# Altium schematic sheet connector2.SchDoc
size A3; SheetNumber: 2; SheetTotal: 6
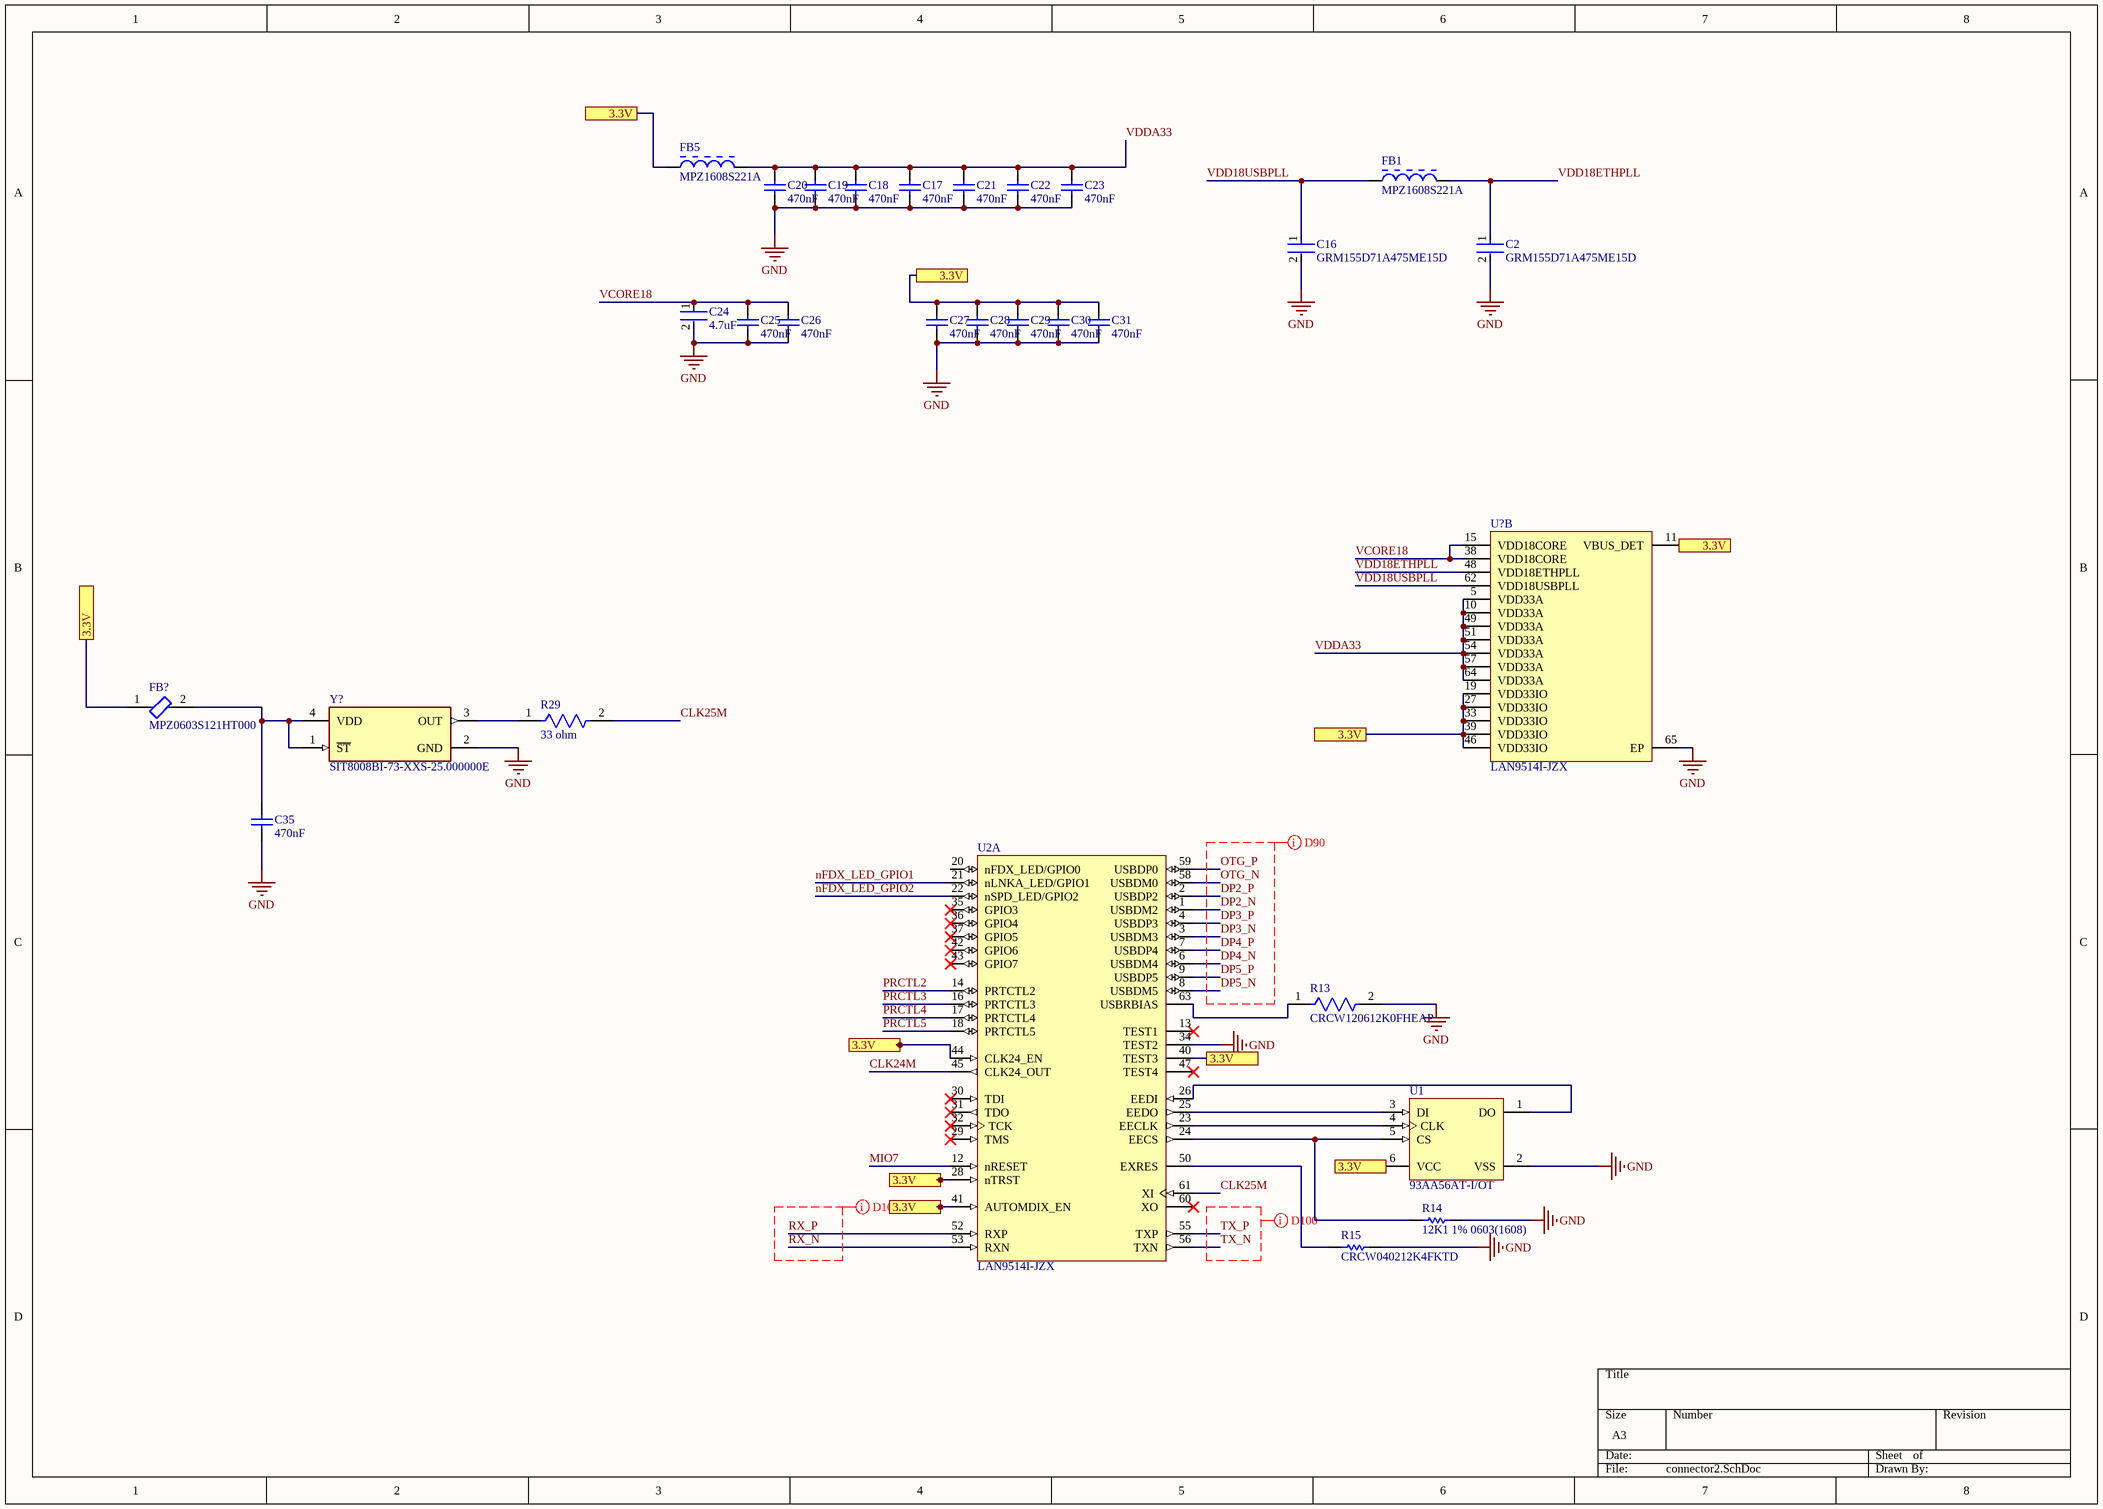
[diagram p0: connector2.SchDoc]

## Parts
C2  GRM155D71A475ME15D  [FP-GRM155-0_2-MFG]
C16  GRM155D71A475ME15D  [FP-GRM155-0_2-MFG]
C17  470nF  [CAPC2013X140X50ML20T25]
C18  470nF  [CAPC2013X140X50ML20T25]
C19  470nF  [CAPC2013X140X50ML20T25]
C20  470nF  [CAPC2013X140X50ML20T25]
C21  470nF  [CAPC2013X140X50ML20T25]
C22  470nF  [CAPC2013X140X50ML20T25]
C23  470nF  [CAPC2013X140X50ML20T25]
C24  4.7uF  [FP-GRM155-0_2-MFG]
C25  470nF  [CAPC2013X140X50ML20T25]
C26  470nF  [CAPC2013X140X50ML20T25]
C27  470nF  [CAPC2013X140X50ML20T25]
C28  470nF  [CAPC2013X140X50ML20T25]
C29  470nF  [CAPC2013X140X50ML20T25]
C30  470nF  [CAPC2013X140X50ML20T25]
C31  470nF  [CAPC2013X140X50ML20T25]
C35  470nF  [CAPC2013X140X50ML20T25]
FB1  MPZ1608S221A  [BEAD1608X95X30VL15T20]
FB5  MPZ1608S221A  [BEAD1608X95X30VL15T20]
FB?  MPZ0603S121HT000  [FP-MPZ0603-IPC_C]
R13  CRCW120612K0FHEAP  [FP-CRCW1206-Pe3-IPC_A]
R14  12K1 1% 0603(1608)  [RESC0603(1608)_M]
R15  CRCW040212K4FKTD  [RESC1005X40X25NL05T05]
R29  33 ohm  [FP-CR0805-IPC_C]
U1  93AA56AT-I/OT  [SOT-23-OT6_M]
U2  LAN9514I-JZX  [MCHP-QFN-64-7300x7300TP_V]  (part A of 2)
U?  LAN9514I-JZX  [MCHP-QFN-64-7300x7300TP_V]  (part B of 2)
Y?  SIT8008BI-73-XXS-25.000000E  [FP-SiT8008-7-MFG]

## Ports
3.3V (see connector1[2A], connector2[1B], connector2[3A], connector2[4A], connector2[4C], connector2[4D], connector2[5C], connector2[6B], connector2[6D], connector2[7B], CPLD[2B], CPLD[2C], CPLD[3A], CPLD[4C], ftdi[1B], ftdi[1C], ftdi[1D], ftdi[2B], ftdi[3C], ftdi[4B]), 3.3V (see connector1[2A], connector2[1B], connector2[3A], connector2[4A], connector2[4C], connector2[4D], connector2[5C], connector2[6B], connector2[6D], CPLD[2B], CPLD[2C], CPLD[3A], CPLD[4C], ftdi[1B], ftdi[1C], ftdi[1D], ftdi[2B], ftdi[3C], ftdi[4B]), 3.3V (see connector1[2A], connector2[1B], connector2[3A], connector2[4A], connector2[4C], connector2[4D], connector2[5C], connector2[6B], connector2[7B], CPLD[2B], CPLD[2C], CPLD[3A], CPLD[4C], ftdi[1B], ftdi[1C], ftdi[1D], ftdi[2B], ftdi[3C], ftdi[4B]), 3.3V (see connector1[2A], connector2[1B], connector2[3A], connector2[4A], connector2[4C], connector2[4D], connector2[5C], connector2[6D], connector2[7B], CPLD[2B], CPLD[2C], CPLD[3A], CPLD[4C], ftdi[1B], ftdi[1C], ftdi[1D], ftdi[2B], ftdi[3C], ftdi[4B]), 3.3V (see connector1[2A], connector2[1B], connector2[3A], connector2[4A], connector2[4C], connector2[4D], connector2[6B], connector2[6D], connector2[7B], CPLD[2B], CPLD[2C], CPLD[3A], CPLD[4C], ftdi[1B], ftdi[1C], ftdi[1D], ftdi[2B], ftdi[3C], ftdi[4B]), 3.3V (see connector1[2A], connector2[1B], connector2[3A], connector2[4A], connector2[4D], connector2[5C], connector2[6B], connector2[6D], connector2[7B], CPLD[2B], CPLD[2C], CPLD[3A], CPLD[4C], ftdi[1B], ftdi[1C], ftdi[1D], ftdi[2B], ftdi[3C], ftdi[4B]), 3.3V (see connector1[2A], connector2[1B], connector2[3A], connector2[4C], connector2[4D], connector2[5C], connector2[6B], connector2[6D], connector2[7B], CPLD[2B], CPLD[2C], CPLD[3A], CPLD[4C], ftdi[1B], ftdi[1C], ftdi[1D], ftdi[2B], ftdi[3C], ftdi[4B]), 3.3V (see connector1[2A], connector2[1B], connector2[4A], connector2[4C], connector2[4D], connector2[5C], connector2[6B], connector2[6D], connector2[7B], CPLD[2B], CPLD[2C], CPLD[3A], CPLD[4C], ftdi[1B], ftdi[1C], ftdi[1D], ftdi[2B], ftdi[3C], ftdi[4B]), 3.3V (see connector1[2A], connector2[3A], connector2[4A], connector2[4C], connector2[4D], connector2[5C], connector2[6B], connector2[6D], connector2[7B], CPLD[2B], CPLD[2C], CPLD[3A], CPLD[4C], ftdi[1B], ftdi[1C], ftdi[1D], ftdi[2B], ftdi[3C], ftdi[4B])

## Nets
GND: C2.2 C16.2 C17.1 C18.1 C19.1 C20.1 C21.1 C22.1 C23.1 C24.2 C25.1 C26.1 C27.1 C28.1 C29.1 C30.1 C31.1 C35.1 R13.2 R14.2 R15.2 U1.2(VSS) U2.34(TEST2) U?.65(EP) Y?.2(GND)
3.3V: C27.2 C28.2 C29.2 C30.2 C31.2 FB5.1 FB?.1 U2.28(nTRST) U2.40(TEST3) U2.41(AUTOMDIX_EN) U2.44(CLK24_EN) U?.11(VBUS_DET) U?.19(VDD33IO) U?.27(VDD33IO) U?.33(VDD33IO) U?.39(VDD33IO) U?.46(VDD33IO) ; port 3.3V
CLK24M: U2.45(CLK24_OUT)
CLK25M: R29.2 U2.61(XI)
DP2_N: U2.1(USBDM2)
DP2_P: U2.2(USBDP2)
DP3_N: U2.3(USBDM3)
DP3_P: U2.4(USBDP3)
DP4_N: U2.6(USBDM4)
DP4_P: U2.7(USBDP4)
DP5_N: U2.8(USBDM5)
DP5_P: U2.9(USBDP5)
MIO7: U2.12(nRESET)
nFDX_LED_GPIO1: U2.21(nLNKA_LED/GPIO1)
nFDX_LED_GPIO2: U2.22(nSPD_LED/GPIO2)
OTG_N: U2.58(USBDM0)
OTG_P: U2.59(USBDP0)
PRCTL2: U2.14(PRTCTL2)
PRCTL3: U2.16(PRTCTL3)
PRCTL4: U2.17(PRTCTL4)
PRCTL5: U2.18(PRTCTL5)
RX_N: U2.53(RXN)
RX_P: U2.52(RXP)
TX_N: U2.56(TXN)
TX_P: U2.55(TXP)
VCORE18: C24.1 C25.2 C26.2 U?.15(VDD18CORE) U?.38(VDD18CORE)
VDD18ETHPLL: C2.1 FB1.2 U?.48(VDD18ETHPLL)
VDD18USBPLL: C16.1 FB1.1 U?.62(VDD18USBPLL)
VDDA33: C17.2 C18.2 C19.2 C20.2 C21.2 C22.2 C23.2 FB5.2 U?.5(VDD33A) U?.10(VDD33A) U?.49(VDD33A) U?.51(VDD33A) U?.54(VDD33A) U?.57(VDD33A) U?.64(VDD33A)
NetC35_2: C35.2 FB?.2 Y?.1(~{ST}) Y?.4(VDD)
NetR13_1: R13.1 U2.63(USBRBIAS)
NetR14_1: R14.1 U1.5(CS) U2.24(EECS)
NetR15_1: R15.1 U2.50(EXRES)
NetR29_1: R29.1 Y?.3(OUT)
NetU1_1: U1.1(DO) U2.26(EEDI)
NetU1_3: U1.3(DI) U2.25(EEDO)
NetU1_4: U1.4(CLK) U2.23(EECLK)

Not connected (* = marked no-connect by the designer): U1 6(VCC); U2 13(TEST1)* 20(nFDX_LED/GPIO0) 29(TMS)* 30(TDI)* 31(TDO)* 32(TCK)* 35(GPIO3)* 36(GPIO4)* 37(GPIO5)* 42(GPIO6)* 43(GPIO7)* 47(TEST4)* 60(XO)*

## Layout directives
differential pair: DP2_N, DP2_P, DP3_N, DP3_P, DP4_N, DP4_P, DP5_N, DP5_P, OTG_N, OTG_P, RX_N, RX_P, TX_N, TX_P

## Library data of the parts
C2 C16 C24 = CMP-00260-57366380-1: GRM155D71A475ME15D Cap Ceramic Monolithic 4.7uF 10VDC 20% SMD Paper T/R; Capacitance: 4.7µF; Dielectric: X7T; Voltage Rating (DC): 10V; Length: 1mm; Thickness: 500µm; NexarPartId: 57366380; Width: 500µm; Case/Package: 0402; Lifecycle Status: Production
C17-C23 C25-C31 C35 = CMP-2007-04634-1: Manufacturer: AVX Interconnect / Elco; Part Number: 08055C474JAT2A
FB1 FB5 = CMP-2000-05070-1: Chip Bead, 220 Ohm, +/- 25%, 2.2 A, 0603 (1608 Metric), RoHS, Tape and Reel; Manufacturer: TDK; Case Length: 1.6mm; Test Frequency: 100MHz; Impedance: 220Ohms; Maximum DC Current: 2A; Maximum DC Resistance: 50mOhms; Case Width: 0.8mm; Manufacturer URL: http://www.tdk.com/; Product: FerriteChipBeads; Product Category: EMIFilterBeads,Chips&Arrays; RoHS: Details; Datasheet Version: Dec-13; Datasheet URL: https://datasheet.ciiva.com/11800/0900766b808078eb-11800910.pdf; Package / Case: 0603(1608metric); Termination Style: SMD/SMT; Packaging: Reel; Factory Pack Quantity: 4000; Operating Temperature Range: -55Cto+125C; Tolerance: 25%; Brand: TDK; Case Height: 0.8mm; Dimensions: 0.8mmWx1.6mmLx0.8mmH
FB? = CMP-08257-000447-1: CHIP BEADS FOR GENERAL SIGNAL LI; Max Current Rating: 1A; DC Resistance (DCR): 130mR; Number of Lines: 1; Min Operating Temperature: -55°C; Mount: Surface Mount; Case Code (Imperial): 0201; Case Code (Metric): 0603; Max Operating Temperature: 125°C; RoHS Compliant: Yes; Packaging: Cut Tape; Case/Package: 0201
R13 = CMP-03613-000193-1: RES Thick Film, 12kΩ, 1%, 0.25W, 50ppm/°C, 1206; Resistance: 12kR; Max Power Dissipation: 250mW; Case/Package: 1206; Series: CRCW-P; Max Operating Temperature: 155°C; Length: 0.126inch; Features: Automotive AEC-Q200; Depth: 1.6mm; Width: 0.063inch; Number of Terminations: 2; Temperature Coefficient: 50ppm/°C; Package Quantity: 5000; Tolerance: 1%; Resistor Type: Thick Film; Height: 0.024inch; Military Standard: Not; Min Operating Temperature: -55°C; RoHS Compliant: Yes; Packaging: Tape and Reel
R14 = CMP-1012-00632-1: 12K1 0.1W 1% 0603 (1608 Metric)  SMD; Case-Metric: 1608; Case-EIA: 0603; Value: 12100.00 Ohm; Power: 0.1 W; Technology: SMT; Tolerance: 1 %
R15 = CMP-2002-08181-1: Manufacturer: Vishay Dale; Part Number: CRCW040212K4FKTD
R29 = CMP-07231-004924-1: Thick Film Chip Resistors 0805 33Ω 0.125W 5% 200ppm/°C; Power Rating: 125mW; Resistance: 33R; Voltage Rating: 150V; Width: 1.25mm; Temperature Coefficient: 200ppm/°C; Case Code (Metric): 2012; Case Code (Imperial): 0805; Termination: SMD/SMT; Height: 0.5mm; Max Operating Temperature: 155°C; Case/Package: 0805; Thickness: 508um; Packaging: Tape and Reel; Min Operating Temperature: -55°C; Length: 2mm; Package Quantity: 10000; Tolerance: 5%
U1 = CMP-0162-00363-1: 2K, 256x8-bit, 1.8V Microwire Serial EEPROM, 6-Pin SOT-23, Industrial Temperature, Tape and Reel; PackageReference: SOT-23-OT6; DatasheetVersion: revF, May-2008; PackageDescription: 6-Lead Plastic Small Outline Transistor (OT) [SOT-23]; Code_IPC: SOT26A-6; PackageVersion: revBB, Aug-2009
U2 U? = CMP-1537-00003-1: USB 2.0 Hub and 10/100 Ethernet Controller, 3.3 V, -40 to 85 degC, 64-Pin QFN, RoHS, Tray; Manufacturer: Microchip; Interface: USB 2.0; Supply Voltage: 3.3 V; Downstreamm USB Ports: 4; DatasheetVersion: Rev. 1.2; RoHS: TRUE; ComponentLink1URL: www.microchip.com/; ComponentLink3Description: Package Specification; PartNumber: LAN9514I-JZX; ComponentLink1Description: Manufacturer URL; ComponentLink2URL: http://ww1.microchip.com/downloads/en/DeviceDoc/9514.pdf; Mounting Technology: Surface Mount; ComponentLink2Description: Datasheet; ComponentLink3URL: http://ww1.microchip.com/downloads/en/DeviceDoc/9514.pdf; Temperature Range: -40 to 85 degC; PackageDescription: 64-Pin Quad Flat Non-Leaded Package, Body 9 x 9 mm, Pitch 0.5 mm; Packing: Tray
Y? = CMP-25159-264763-1: 25 MHz XO (Standard) HCMOS, LVCMOS Oscillator 2.5V ~ 3.3V Standby (Power Down) 4-SMD, No Lead; Max Supply Current: 4.5mA; Frequency: 25MHz; Frequency Stability: 50ppm; Min Operating Temperature: -40°C; Packaging: Tape and Reel; Series: SIT8008B; Mount: Surface Mount; RoHS Compliant: Yes; Max Operating Temperature: 85°C; Case/Package: SMD/SMT